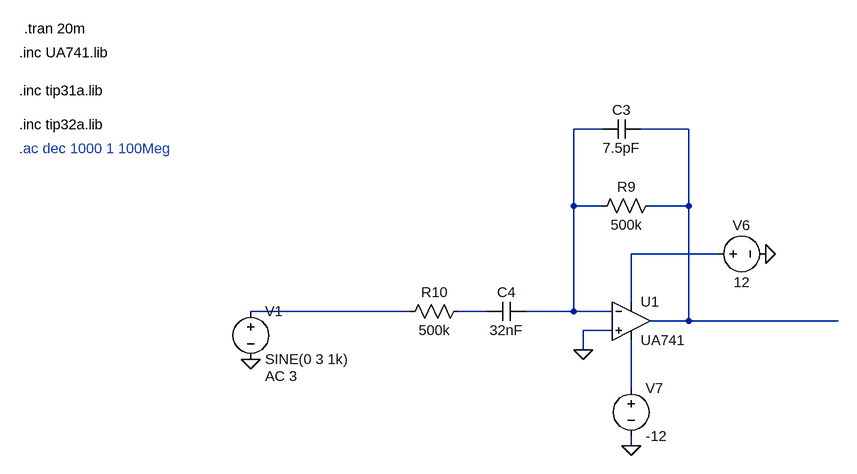
[diagram p0: schematic 3rd-stage(BPF).asc]
3rd-stage(BPF).asc, the LTspice schematic file:
Version 4.1
SHEET 1 2132 996
WIRE 848 -144 800 -144
WIRE 992 -144 912 -144
WIRE 800 -16 800 -144
WIRE 848 -16 800 -16
WIRE 992 -16 992 -144
WIRE 992 -16 928 -16
WIRE 1040 64 896 64
WIRE 896 144 896 64
WIRE 528 160 112 160
WIRE 656 160 608 160
WIRE 800 160 800 -16
WIRE 800 160 720 160
WIRE 864 160 800 160
WIRE 992 176 992 -16
WIRE 992 176 928 176
WIRE 1264 176 992 176
WIRE 864 192 816 192
WIRE 816 224 816 192
WIRE 896 288 896 208
WIRE 896 384 896 368
FLAG 816 224 0
FLAG 896 384 0
FLAG 1120 64 0
FLAG 112 240 0
SYMBOL OpAmps\\opamp2 896 112 R0
SYMATTR InstName U1
SYMATTR Value UA741
SYMBOL res 944 -32 R90
WINDOW 0 0 56 VBottom 2
WINDOW 3 32 56 VTop 2
SYMATTR InstName R9
SYMATTR Value 500k
SYMBOL cap 912 -160 R90
WINDOW 0 0 32 VBottom 2
WINDOW 3 32 32 VTop 2
SYMATTR InstName C3
SYMATTR Value 7.5pF
SYMBOL cap 720 144 R90
WINDOW 0 0 32 VBottom 2
WINDOW 3 32 32 VTop 2
SYMATTR InstName C4
SYMATTR Value 32nF
SYMBOL res 624 144 R90
WINDOW 0 0 56 VBottom 2
WINDOW 3 32 56 VTop 2
SYMATTR InstName R10
SYMATTR Value 500k
SYMBOL voltage 1024 64 R270
WINDOW 0 32 56 VTop 2
WINDOW 3 -32 56 VBottom 2
WINDOW 123 0 0 Left 0
WINDOW 39 0 0 Left 0
SYMATTR InstName V6
SYMATTR Value 12
SYMBOL voltage 896 272 R0
SYMATTR InstName V7
SYMATTR Value -12
SYMBOL voltage 112 144 R0
WINDOW 123 24 124 Left 2
WINDOW 39 0 0 Left 0
SYMATTR Value2 AC 3
SYMATTR InstName V1
SYMATTR Value SINE(0 3 1k)
TEXT -2104 -272 Left 2 !.inc UA741.lib
TEXT -2104 -208 Left 2 !.inc tip31a.lib
TEXT -2104 -152 Left 2 !.inc tip32a.lib
TEXT -2096 -312 Left 2 !.tran 20m
TEXT -2104 -112 Left 2 ;.ac dec 1000 1 100Meg

The netlist it stands for:
* 3rd-stage(BPF).asc
X§U1 0 N001 N003 N006 N002 UA741  ; pins In+ In- V+ V- OUT
R9 N002 N001 500k
C3 N002 N001 7.5pF
C4 N001 N005 32nF
R10 N005 N004 500k
V6 N003 0 12
V7 N006 0 -12
V1 N004 0 SINE(0 3 1k) AC 3
.inc UA741.lib
.inc tip31a.lib
.inc tip32a.lib
.tran 20m
* .ac dec 1000 1 100Meg
.backanno
.end